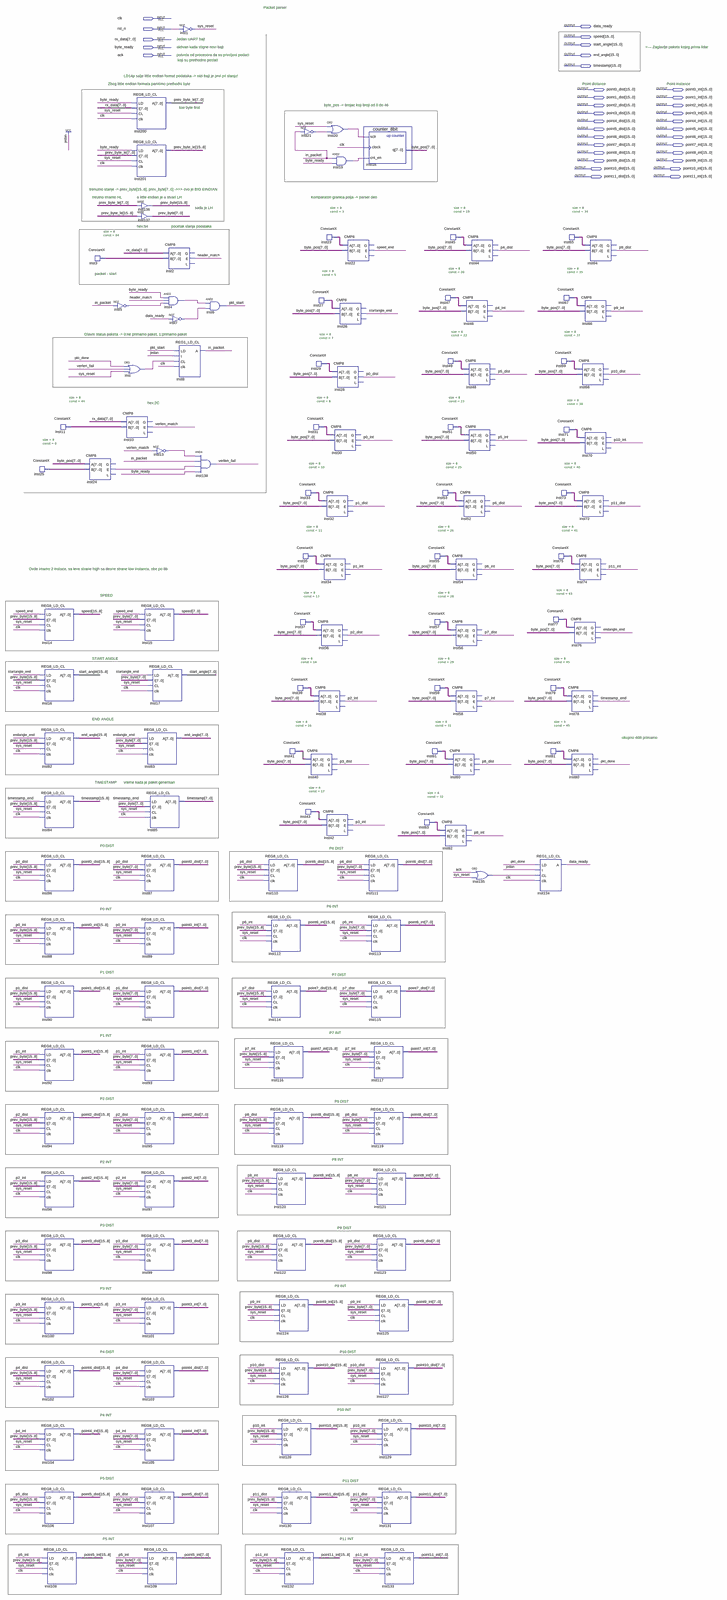
[diagram p0: schematic sheet, whole]
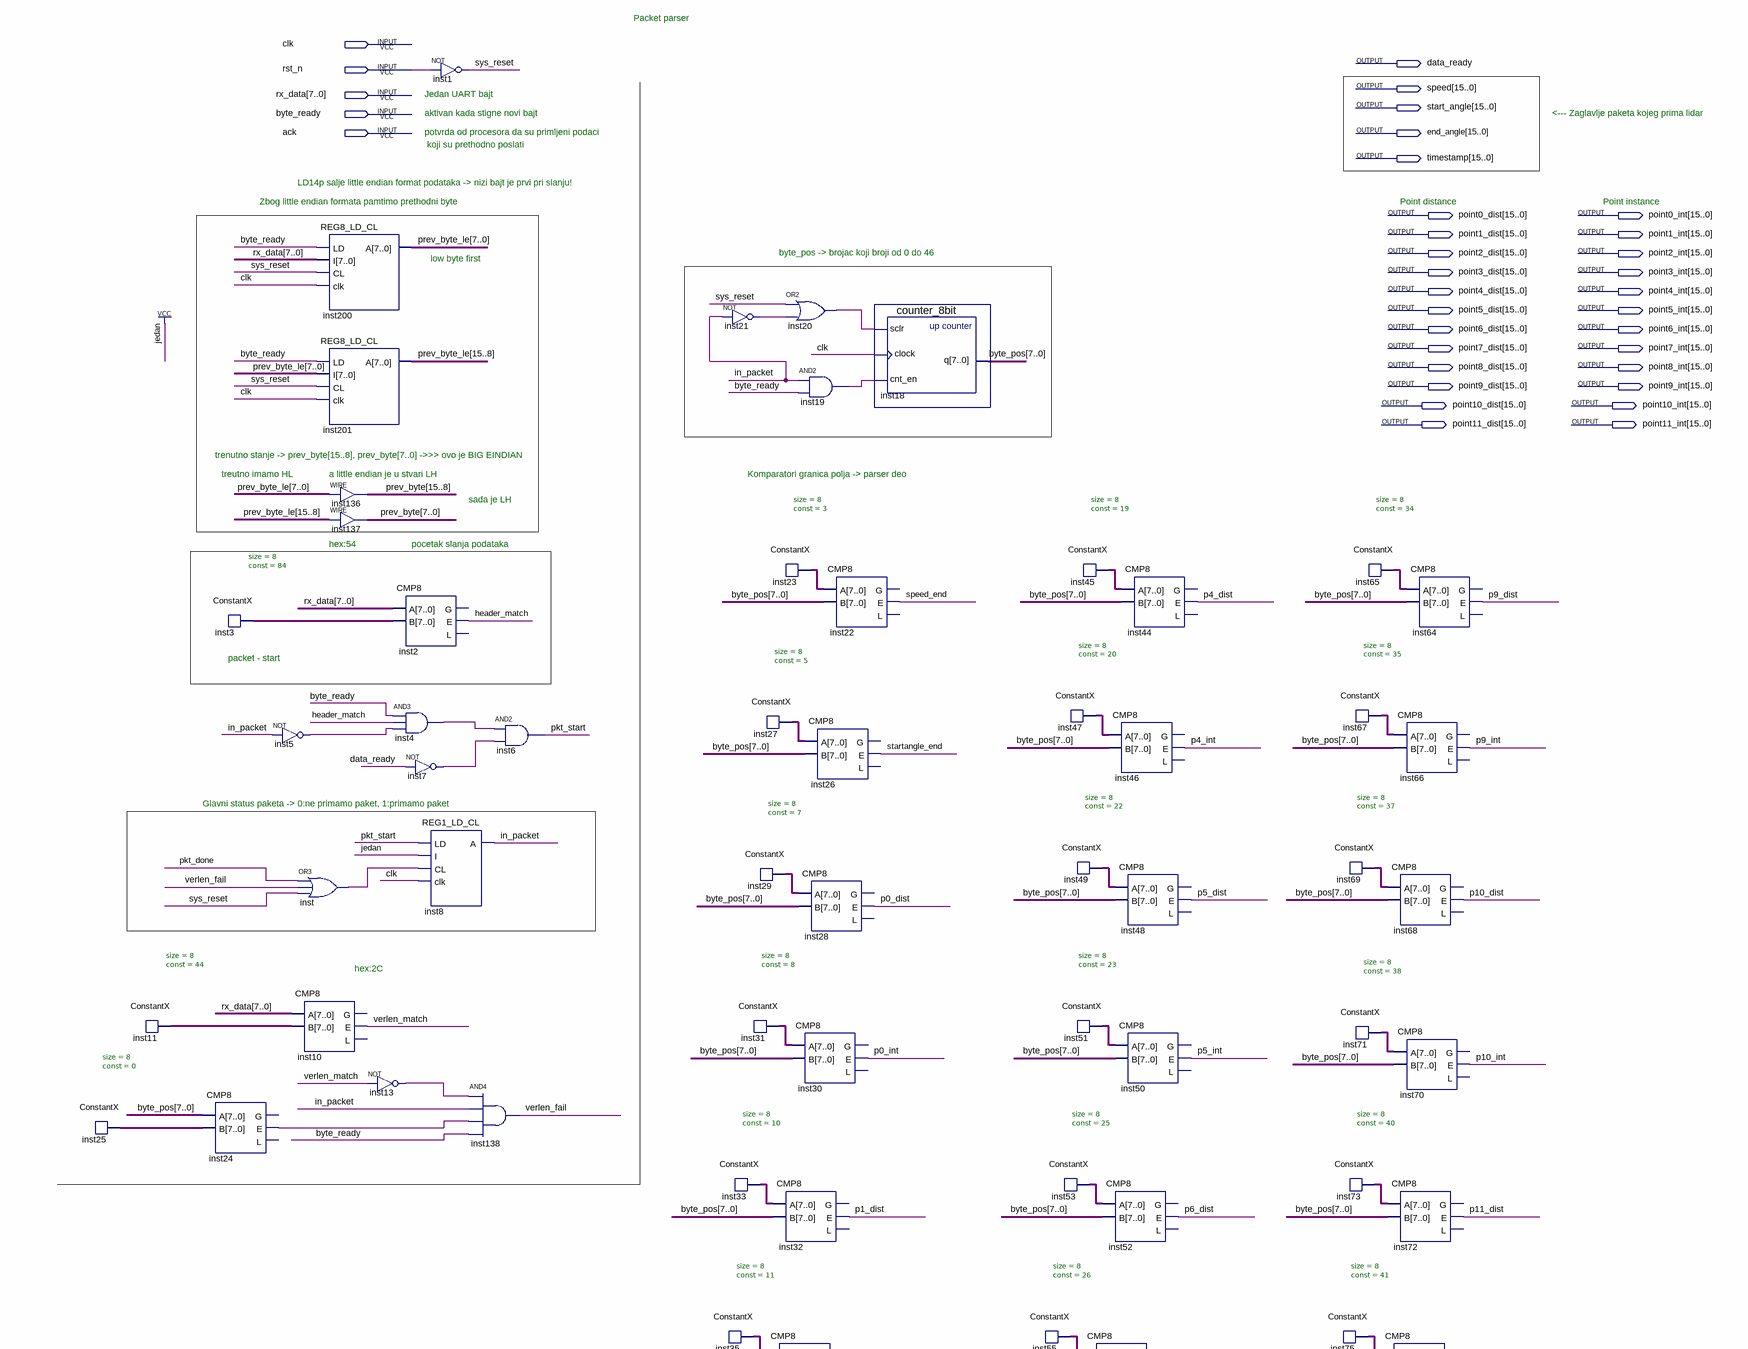
[diagram p1: schematic sheet, upper part]
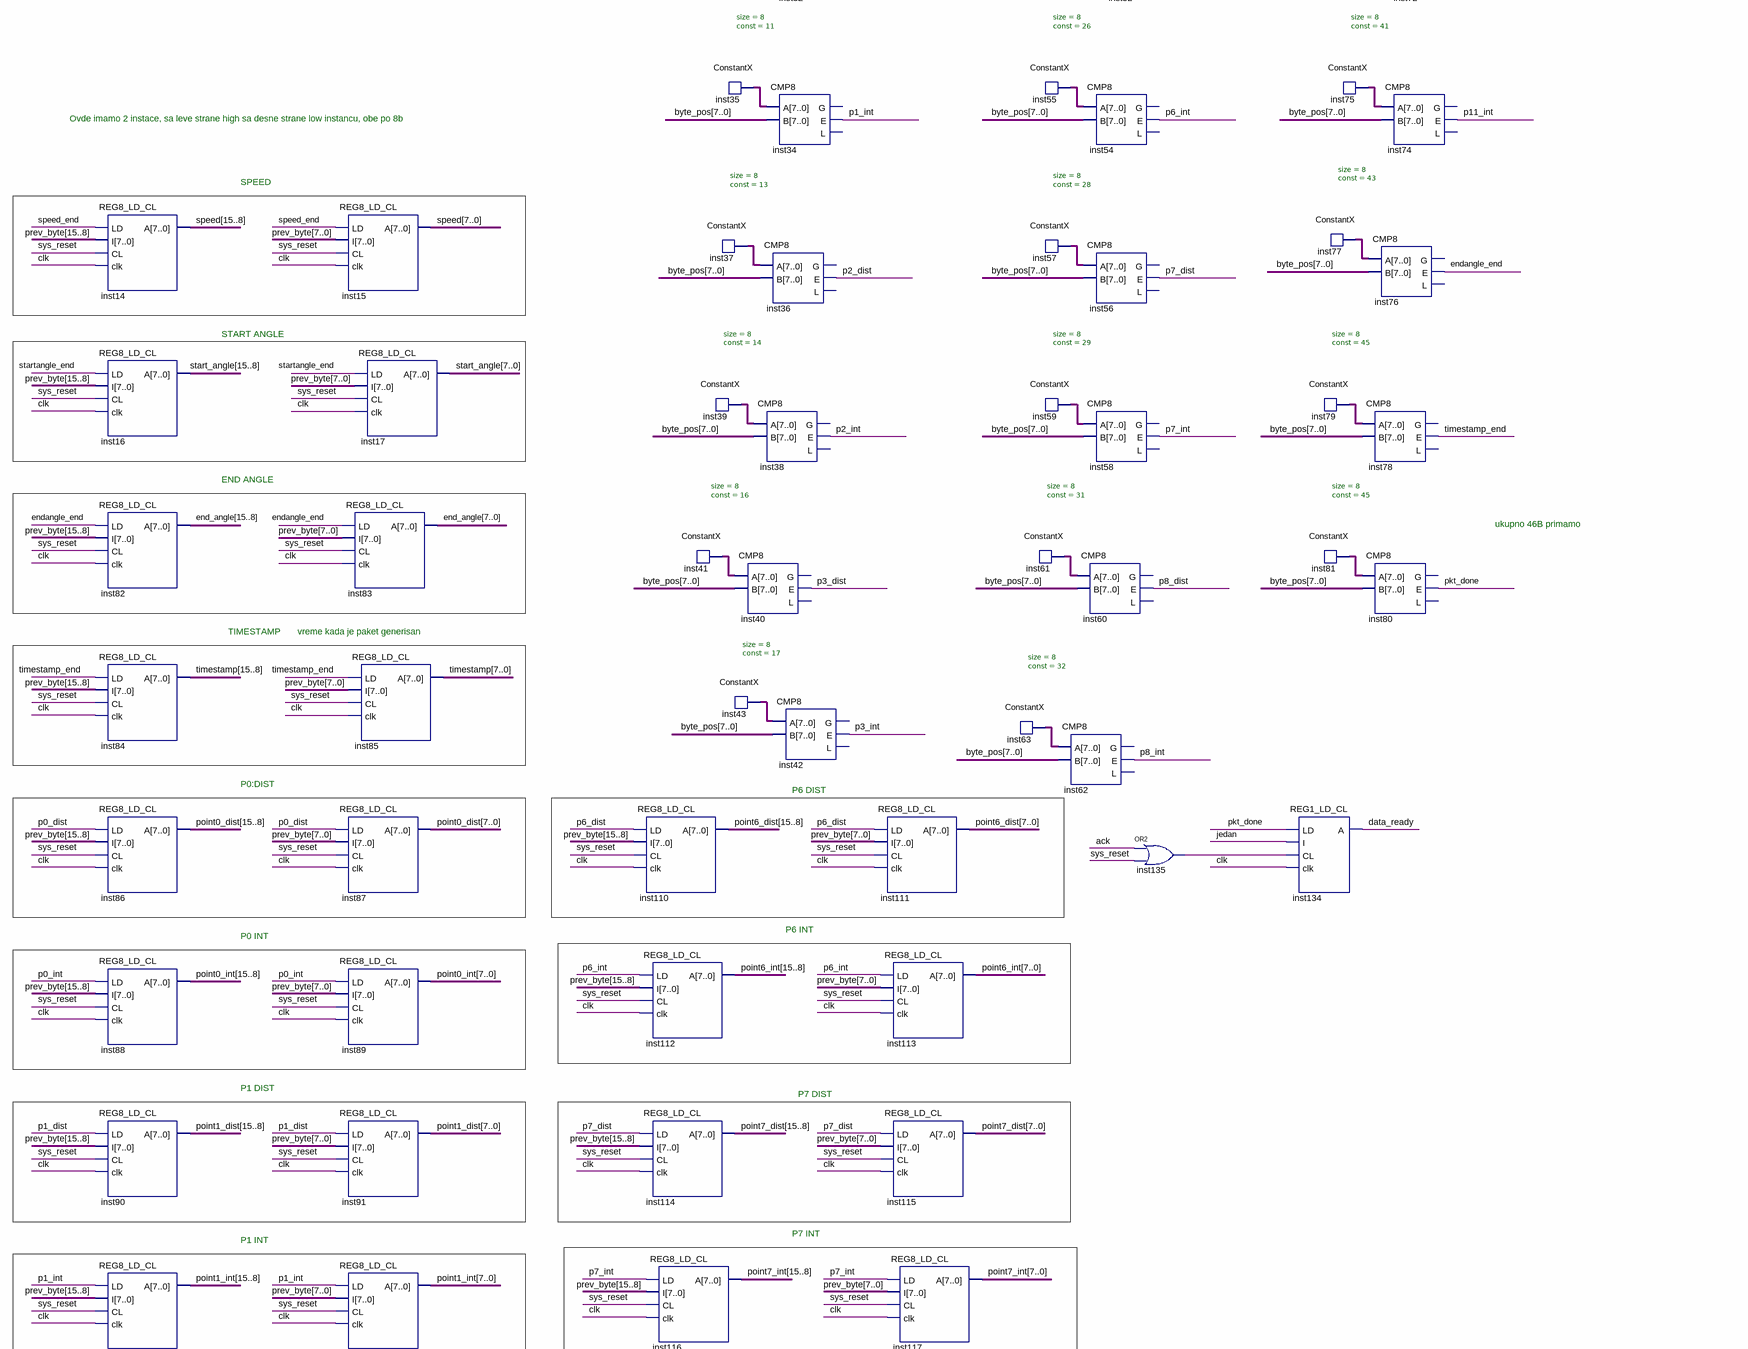
[diagram p2: schematic sheet, middle part]
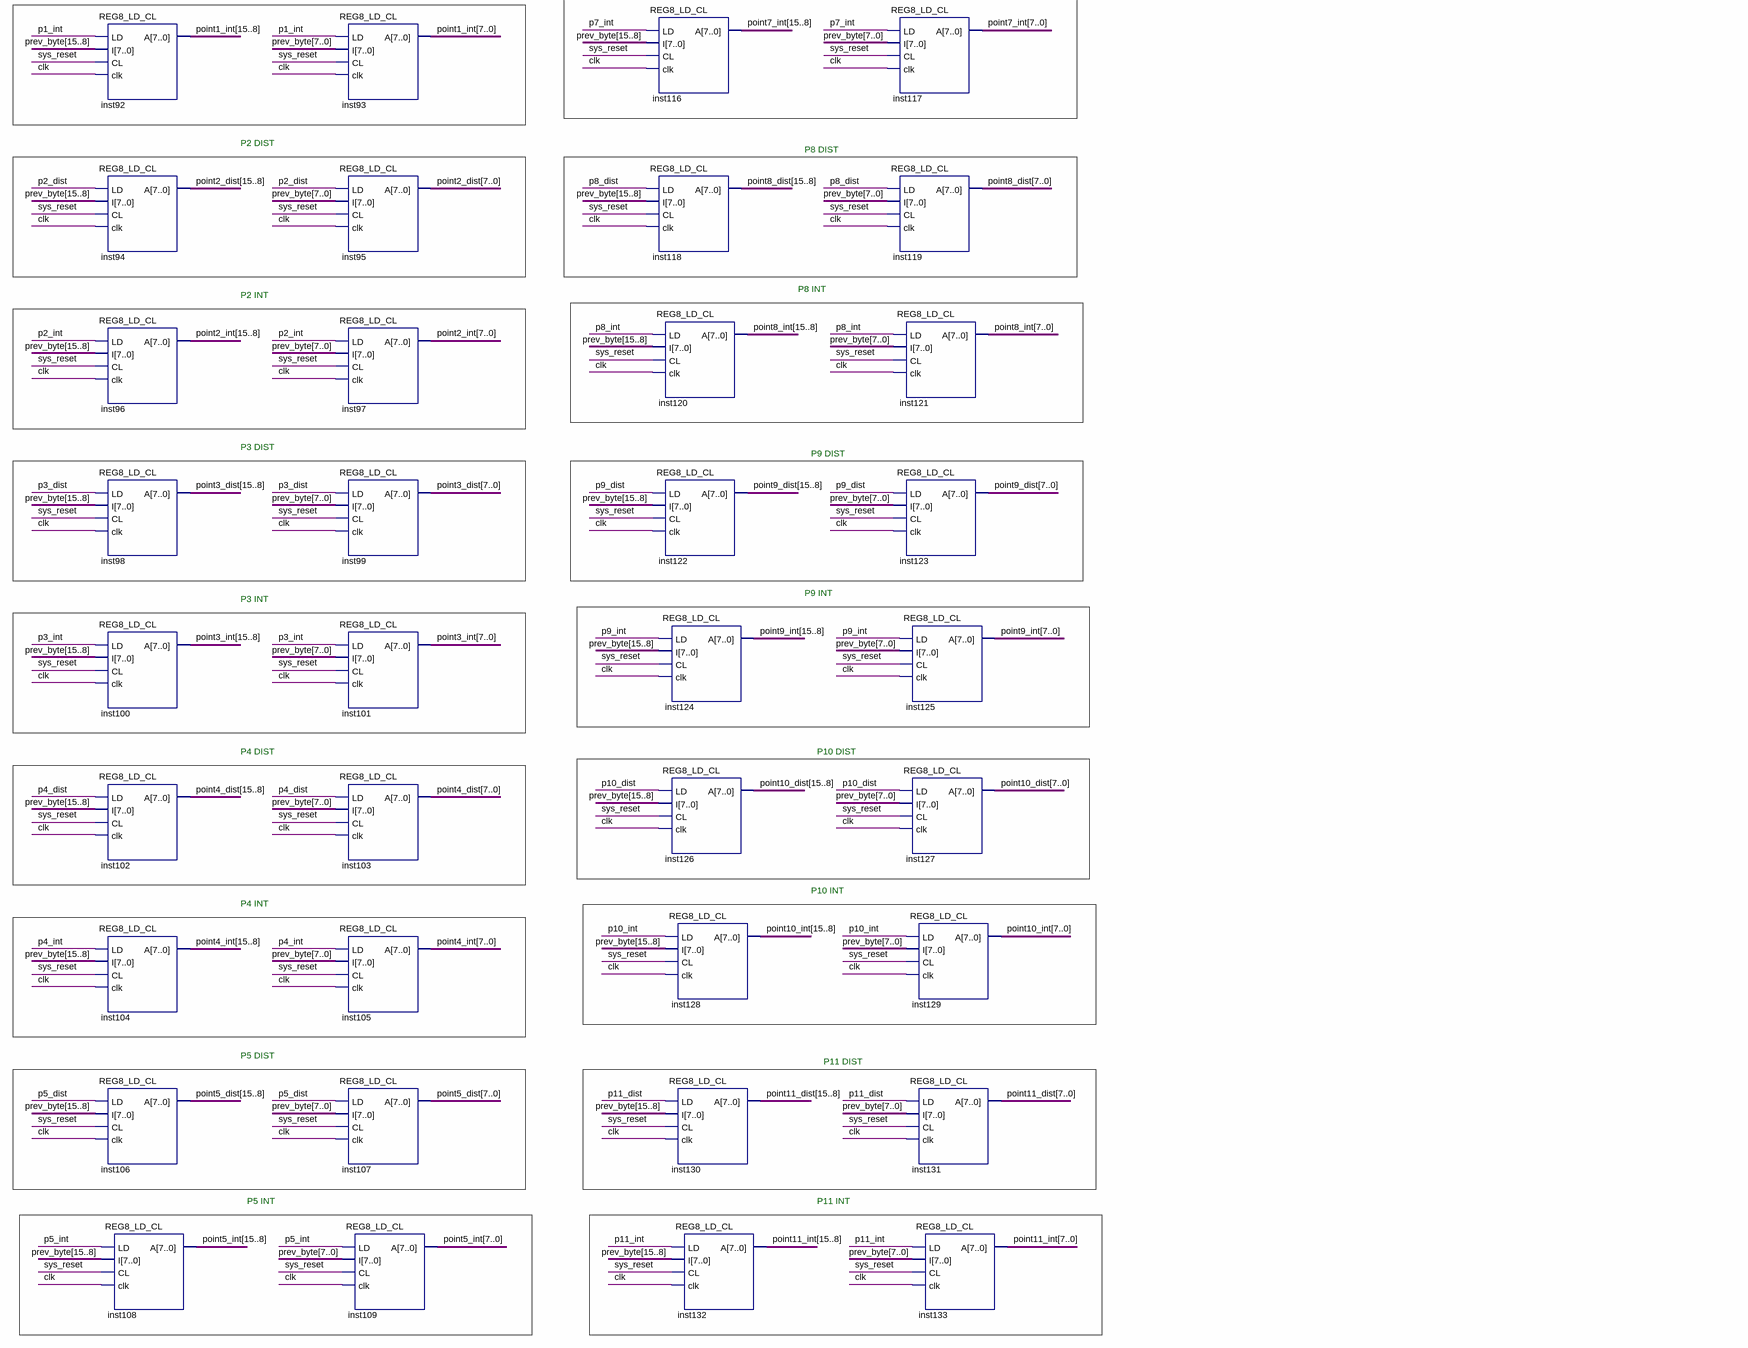
[diagram p3: schematic sheet, lower part]
// Quartus schematic PacketParser.bdf as structural Verilog: 139 symbols, 34 pins
module PacketParser (
  input  clk,
  input  rst_n,
  input  [7:0] rx_data,
  input  byte_ready,
  input  ack,
  output data_ready,
  output [15:0] speed,
  output [15:0] start_angle,
  output [15:0] end_angle,
  output [15:0] timestamp,
  output [15:0] point0_dist,
  output [15:0] point0_int,
  output [15:0] point1_dist,
  output [15:0] point1_int,
  output [15:0] point2_dist,
  output [15:0] point2_int,
  output [15:0] point3_dist,
  output [15:0] point3_int,
  output [15:0] point4_dist,
  output [15:0] point4_int,
  output [15:0] point5_dist,
  output [15:0] point5_int,
  output [15:0] point6_dist,
  output [15:0] point6_int,
  output [15:0] point7_dist,
  output [15:0] point7_int,
  output [15:0] point8_dist,
  output [15:0] point8_int,
  output [15:0] point9_dist,
  output [15:0] point9_int,
  output [15:0] point10_dist,
  output [15:0] point10_int,
  output [15:0] point11_dist,
  output [15:0] point11_int
);

  wire endangle_end, header_match, in_packet, inst4_out, inst5_out, inst7_out, inst13_out, inst19_out,
       inst20_out, inst21_out, inst24_e, inst135_out, inst_out, p0_dist, p0_int, p1_dist, p1_int, p2_dist,
       p2_int, p3_dist, p3_int, p4_dist, p4_int, p5_dist, p5_int, p6_dist, p6_int, p7_dist, p7_int, p8_dist,
       p8_int, p9_dist, p9_int, p10_dist, p10_int, p11_dist, p11_int, pkt_done, pkt_start, speed_end,
       startangle_end, sys_reset, timestamp_end, verlen_fail, verlen_match;
  wire [7:0] byte_pos, inst3_data_out, inst11_data_out, inst23_data_out, inst25_data_out, inst27_data_out,
       inst29_data_out, inst31_data_out, inst33_data_out, inst35_data_out, inst37_data_out, inst39_data_out,
       inst41_data_out, inst43_data_out, inst45_data_out, inst47_data_out, inst49_data_out, inst51_data_out,
       inst53_data_out, inst55_data_out, inst57_data_out, inst59_data_out, inst61_data_out, inst63_data_out,
       inst65_data_out, inst67_data_out, inst69_data_out, inst71_data_out, inst73_data_out, inst75_data_out,
       inst77_data_out, inst79_data_out, inst81_data_out;
  wire [15:0] prev_byte, prev_byte_le;

  ConstantX #(.size(8), .\const (0)) inst25 (.DATA_OUT(inst25_data_out));
  REG8_LD_CL inst14 (.LD(speed_end), .I(prev_byte[15:8]), .CL(sys_reset), .clk(clk), .A(speed[15:8]));
  REG8_LD_CL inst16 (.LD(startangle_end), .I(prev_byte[15:8]), .CL(sys_reset), .clk(clk), .A(start_angle[15:8]));
  REG8_LD_CL inst82 (.LD(endangle_end), .I(prev_byte[15:8]), .CL(sys_reset), .clk(clk), .A(end_angle[15:8]));
  REG8_LD_CL inst84 (.LD(timestamp_end), .I(prev_byte[15:8]), .CL(sys_reset), .clk(clk), .A(timestamp[15:8]));
  REG8_LD_CL inst86 (.LD(p0_dist), .I(prev_byte[15:8]), .CL(sys_reset), .clk(clk), .A(point0_dist[15:8]));
  REG8_LD_CL inst88 (.LD(p0_int), .I(prev_byte[15:8]), .CL(sys_reset), .clk(clk), .A(point0_int[15:8]));
  REG8_LD_CL inst90 (.LD(p1_dist), .I(prev_byte[15:8]), .CL(sys_reset), .clk(clk), .A(point1_dist[15:8]));
  REG8_LD_CL inst92 (.LD(p1_int), .I(prev_byte[15:8]), .CL(sys_reset), .clk(clk), .A(point1_int[15:8]));
  REG8_LD_CL inst94 (.LD(p2_dist), .I(prev_byte[15:8]), .CL(sys_reset), .clk(clk), .A(point2_dist[15:8]));
  REG8_LD_CL inst96 (.LD(p2_int), .I(prev_byte[15:8]), .CL(sys_reset), .clk(clk), .A(point2_int[15:8]));
  REG8_LD_CL inst98 (.LD(p3_dist), .I(prev_byte[15:8]), .CL(sys_reset), .clk(clk), .A(point3_dist[15:8]));
  REG8_LD_CL inst100 (.LD(p3_int), .I(prev_byte[15:8]), .CL(sys_reset), .clk(clk), .A(point3_int[15:8]));
  REG8_LD_CL inst102 (.LD(p4_dist), .I(prev_byte[15:8]), .CL(sys_reset), .clk(clk), .A(point4_dist[15:8]));
  REG8_LD_CL inst104 (.LD(p4_int), .I(prev_byte[15:8]), .CL(sys_reset), .clk(clk), .A(point4_int[15:8]));
  REG8_LD_CL inst106 (.LD(p5_dist), .I(prev_byte[15:8]), .CL(sys_reset), .clk(clk), .A(point5_dist[15:8]));
  REG8_LD_CL inst108 (.LD(p5_int), .I(prev_byte[15:8]), .CL(sys_reset), .clk(clk), .A(point5_int[15:8]));
  ConstantX #(.size(8), .\const (44)) inst11 (.DATA_OUT(inst11_data_out));
  ConstantX #(.size(8), .\const (84)) inst3 (.DATA_OUT(inst3_data_out));
  CMP8 inst24 (.A(byte_pos), .B(inst25_data_out), .E(inst24_e));  // open: G, L
  not inst5 (inst5_out, in_packet);
  REG8_LD_CL inst200 (.LD(byte_ready), .I(rx_data), .CL(sys_reset), .clk(clk), .A(prev_byte_le[7:0]));
  REG8_LD_CL inst201 (.LD(byte_ready), .I(prev_byte_le[7:0]), .CL(sys_reset), .clk(clk), .A(prev_byte_le[15:8]));
  or inst (inst_out, pkt_done, verlen_fail, sys_reset);
  CMP8 inst10 (.A(rx_data), .B(inst11_data_out), .E(verlen_match));  // open: G, L
  assign prev_byte[15:8] = prev_byte_le[7:0];  // WIRE inst136
  assign prev_byte[7:0] = prev_byte_le[15:8];  // WIRE inst137
  not inst13 (inst13_out, verlen_match);
  REG8_LD_CL inst15 (.LD(speed_end), .I(prev_byte[7:0]), .CL(sys_reset), .clk(clk), .A(speed[7:0]));
  REG8_LD_CL inst17 (.LD(startangle_end), .I(prev_byte[7:0]), .CL(sys_reset), .clk(clk), .A(start_angle[7:0]));
  REG8_LD_CL inst83 (.LD(endangle_end), .I(prev_byte[7:0]), .CL(sys_reset), .clk(clk), .A(end_angle[7:0]));
  REG8_LD_CL inst85 (.LD(timestamp_end), .I(prev_byte[7:0]), .CL(sys_reset), .clk(clk), .A(timestamp[7:0]));
  REG8_LD_CL inst87 (.LD(p0_dist), .I(prev_byte[7:0]), .CL(sys_reset), .clk(clk), .A(point0_dist[7:0]));
  REG8_LD_CL inst89 (.LD(p0_int), .I(prev_byte[7:0]), .CL(sys_reset), .clk(clk), .A(point0_int[7:0]));
  REG8_LD_CL inst91 (.LD(p1_dist), .I(prev_byte[7:0]), .CL(sys_reset), .clk(clk), .A(point1_dist[7:0]));
  REG8_LD_CL inst93 (.LD(p1_int), .I(prev_byte[7:0]), .CL(sys_reset), .clk(clk), .A(point1_int[7:0]));
  REG8_LD_CL inst95 (.LD(p2_dist), .I(prev_byte[7:0]), .CL(sys_reset), .clk(clk), .A(point2_dist[7:0]));
  REG8_LD_CL inst97 (.LD(p2_int), .I(prev_byte[7:0]), .CL(sys_reset), .clk(clk), .A(point2_int[7:0]));
  REG8_LD_CL inst99 (.LD(p3_dist), .I(prev_byte[7:0]), .CL(sys_reset), .clk(clk), .A(point3_dist[7:0]));
  REG8_LD_CL inst101 (.LD(p3_int), .I(prev_byte[7:0]), .CL(sys_reset), .clk(clk), .A(point3_int[7:0]));
  REG8_LD_CL inst103 (.LD(p4_dist), .I(prev_byte[7:0]), .CL(sys_reset), .clk(clk), .A(point4_dist[7:0]));
  REG8_LD_CL inst105 (.LD(p4_int), .I(prev_byte[7:0]), .CL(sys_reset), .clk(clk), .A(point4_int[7:0]));
  REG8_LD_CL inst107 (.LD(p5_dist), .I(prev_byte[7:0]), .CL(sys_reset), .clk(clk), .A(point5_dist[7:0]));
  REG8_LD_CL inst109 (.LD(p5_int), .I(prev_byte[7:0]), .CL(sys_reset), .clk(clk), .A(point5_int[7:0]));
  CMP8 inst2 (.A(rx_data), .B(inst3_data_out), .E(header_match));  // open: G, L
  and inst4 (inst4_out, byte_ready, header_match, inst5_out);
  not inst7 (inst7_out, data_ready);
  REG1_LD_CL inst8 (.LD(pkt_start), .I(1'b1), .CL(inst_out), .clk(clk), .A(in_packet));
  not inst1 (sys_reset, rst_n);
  and inst138 (verlen_fail, inst13_out, in_packet, inst24_e, byte_ready);
  and inst6 (pkt_start, inst4_out, inst7_out);
  ConstantX #(.size(8), .\const (16)) inst41 (.DATA_OUT(inst41_data_out));
  REG8_LD_CL inst110 (.LD(p6_dist), .I(prev_byte[15:8]), .CL(sys_reset), .clk(clk), .A(point6_dist[15:8]));
  REG8_LD_CL inst112 (.LD(p6_int), .I(prev_byte[15:8]), .CL(sys_reset), .clk(clk), .A(point6_int[15:8]));
  REG8_LD_CL inst114 (.LD(p7_dist), .I(prev_byte[15:8]), .CL(sys_reset), .clk(clk), .A(point7_dist[15:8]));
  REG8_LD_CL inst116 (.LD(p7_int), .I(prev_byte[15:8]), .CL(sys_reset), .clk(clk), .A(point7_int[15:8]));
  REG8_LD_CL inst118 (.LD(p8_dist), .I(prev_byte[15:8]), .CL(sys_reset), .clk(clk), .A(point8_dist[15:8]));
  REG8_LD_CL inst120 (.LD(p8_int), .I(prev_byte[15:8]), .CL(sys_reset), .clk(clk), .A(point8_int[15:8]));
  REG8_LD_CL inst122 (.LD(p9_dist), .I(prev_byte[15:8]), .CL(sys_reset), .clk(clk), .A(point9_dist[15:8]));
  REG8_LD_CL inst124 (.LD(p9_int), .I(prev_byte[15:8]), .CL(sys_reset), .clk(clk), .A(point9_int[15:8]));
  REG8_LD_CL inst126 (.LD(p10_dist), .I(prev_byte[15:8]), .CL(sys_reset), .clk(clk), .A(point10_dist[15:8]));
  REG8_LD_CL inst128 (.LD(p10_int), .I(prev_byte[15:8]), .CL(sys_reset), .clk(clk), .A(point10_int[15:8]));
  REG8_LD_CL inst130 (.LD(p11_dist), .I(prev_byte[15:8]), .CL(sys_reset), .clk(clk), .A(point11_dist[15:8]));
  REG8_LD_CL inst132 (.LD(p11_int), .I(prev_byte[15:8]), .CL(sys_reset), .clk(clk), .A(point11_int[15:8]));
  not inst21 (inst21_out, in_packet);
  ConstantX #(.size(8), .\const (10)) inst33 (.DATA_OUT(inst33_data_out));
  ConstantX #(.size(8), .\const (11)) inst35 (.DATA_OUT(inst35_data_out));
  ConstantX #(.size(8), .\const (13)) inst37 (.DATA_OUT(inst37_data_out));
  ConstantX #(.size(8), .\const (14)) inst39 (.DATA_OUT(inst39_data_out));
  ConstantX #(.size(8), .\const (17)) inst43 (.DATA_OUT(inst43_data_out));
  ConstantX #(.size(8), .\const (3)) inst23 (.DATA_OUT(inst23_data_out));
  ConstantX #(.size(8), .\const (5)) inst27 (.DATA_OUT(inst27_data_out));
  ConstantX #(.size(8), .\const (7)) inst29 (.DATA_OUT(inst29_data_out));
  ConstantX #(.size(8), .\const (8)) inst31 (.DATA_OUT(inst31_data_out));
  CMP8 inst32 (.A(inst33_data_out), .B(byte_pos), .E(p1_dist));  // open: G, L
  CMP8 inst34 (.A(inst35_data_out), .B(byte_pos), .E(p1_int));  // open: G, L
  CMP8 inst36 (.A(inst37_data_out), .B(byte_pos), .E(p2_dist));  // open: G, L
  CMP8 inst38 (.A(inst39_data_out), .B(byte_pos), .E(p2_int));  // open: G, L
  CMP8 inst40 (.A(inst41_data_out), .B(byte_pos), .E(p3_dist));  // open: G, L
  CMP8 inst42 (.A(inst43_data_out), .B(byte_pos), .E(p3_int));  // open: G, L
  or inst20 (inst20_out, sys_reset, inst21_out);
  and inst19 (inst19_out, in_packet, byte_ready);
  CMP8 inst22 (.A(inst23_data_out), .B(byte_pos), .E(speed_end));  // open: G, L
  CMP8 inst26 (.A(inst27_data_out), .B(byte_pos), .E(startangle_end));  // open: G, L
  CMP8 inst28 (.A(inst29_data_out), .B(byte_pos), .E(p0_dist));  // open: G, L
  CMP8 inst30 (.A(inst31_data_out), .B(byte_pos), .E(p0_int));  // open: G, L
  counter_8bit inst18 (.sclr(inst20_out), .clock(clk), .cnt_en(inst19_out), .q(byte_pos));
  REG8_LD_CL inst111 (.LD(p6_dist), .I(prev_byte[7:0]), .CL(sys_reset), .clk(clk), .A(point6_dist[7:0]));
  REG8_LD_CL inst113 (.LD(p6_int), .I(prev_byte[7:0]), .CL(sys_reset), .clk(clk), .A(point6_int[7:0]));
  REG8_LD_CL inst115 (.LD(p7_dist), .I(prev_byte[7:0]), .CL(sys_reset), .clk(clk), .A(point7_dist[7:0]));
  REG8_LD_CL inst117 (.LD(p7_int), .I(prev_byte[7:0]), .CL(sys_reset), .clk(clk), .A(point7_int[7:0]));
  REG8_LD_CL inst119 (.LD(p8_dist), .I(prev_byte[7:0]), .CL(sys_reset), .clk(clk), .A(point8_dist[7:0]));
  REG8_LD_CL inst121 (.LD(p8_int), .I(prev_byte[7:0]), .CL(sys_reset), .clk(clk), .A(point8_int[7:0]));
  REG8_LD_CL inst123 (.LD(p9_dist), .I(prev_byte[7:0]), .CL(sys_reset), .clk(clk), .A(point9_dist[7:0]));
  REG8_LD_CL inst125 (.LD(p9_int), .I(prev_byte[7:0]), .CL(sys_reset), .clk(clk), .A(point9_int[7:0]));
  REG8_LD_CL inst127 (.LD(p10_dist), .I(prev_byte[7:0]), .CL(sys_reset), .clk(clk), .A(point10_dist[7:0]));
  REG8_LD_CL inst129 (.LD(p10_int), .I(prev_byte[7:0]), .CL(sys_reset), .clk(clk), .A(point10_int[7:0]));
  REG8_LD_CL inst131 (.LD(p11_dist), .I(prev_byte[7:0]), .CL(sys_reset), .clk(clk), .A(point11_dist[7:0]));
  REG8_LD_CL inst133 (.LD(p11_int), .I(prev_byte[7:0]), .CL(sys_reset), .clk(clk), .A(point11_int[7:0]));
  ConstantX #(.size(8), .\const (26)) inst55 (.DATA_OUT(inst55_data_out));
  ConstantX #(.size(8), .\const (28)) inst57 (.DATA_OUT(inst57_data_out));
  ConstantX #(.size(8), .\const (29)) inst59 (.DATA_OUT(inst59_data_out));
  ConstantX #(.size(8), .\const (31)) inst61 (.DATA_OUT(inst61_data_out));
  ConstantX #(.size(8), .\const (32)) inst63 (.DATA_OUT(inst63_data_out));
  ConstantX #(.size(8), .\const (19)) inst45 (.DATA_OUT(inst45_data_out));
  ConstantX #(.size(8), .\const (20)) inst47 (.DATA_OUT(inst47_data_out));
  ConstantX #(.size(8), .\const (22)) inst49 (.DATA_OUT(inst49_data_out));
  ConstantX #(.size(8), .\const (23)) inst51 (.DATA_OUT(inst51_data_out));
  ConstantX #(.size(8), .\const (25)) inst53 (.DATA_OUT(inst53_data_out));
  CMP8 inst54 (.A(inst55_data_out), .B(byte_pos), .E(p6_int));  // open: G, L
  CMP8 inst56 (.A(inst57_data_out), .B(byte_pos), .E(p7_dist));  // open: G, L
  CMP8 inst58 (.A(inst59_data_out), .B(byte_pos), .E(p7_int));  // open: G, L
  CMP8 inst60 (.A(inst61_data_out), .B(byte_pos), .E(p8_dist));  // open: G, L
  CMP8 inst62 (.A(inst63_data_out), .B(byte_pos), .E(p8_int));  // open: G, L
  CMP8 inst44 (.A(inst45_data_out), .B(byte_pos), .E(p4_dist));  // open: G, L
  CMP8 inst46 (.A(inst47_data_out), .B(byte_pos), .E(p4_int));  // open: G, L
  CMP8 inst48 (.A(inst49_data_out), .B(byte_pos), .E(p5_dist));  // open: G, L
  CMP8 inst50 (.A(inst51_data_out), .B(byte_pos), .E(p5_int));  // open: G, L
  CMP8 inst52 (.A(inst53_data_out), .B(byte_pos), .E(p6_dist));  // open: G, L
  or inst135 (inst135_out, ack, sys_reset);
  REG1_LD_CL inst134 (.LD(pkt_done), .I(1'b1), .CL(inst135_out), .clk(clk), .A(data_ready));
  ConstantX #(.size(8), .\const (35)) inst67 (.DATA_OUT(inst67_data_out));
  ConstantX #(.size(8), .\const (37)) inst69 (.DATA_OUT(inst69_data_out));
  ConstantX #(.size(8), .\const (38)) inst71 (.DATA_OUT(inst71_data_out));
  ConstantX #(.size(8), .\const (40)) inst73 (.DATA_OUT(inst73_data_out));
  ConstantX #(.size(8), .\const (41)) inst75 (.DATA_OUT(inst75_data_out));
  ConstantX #(.size(8), .\const (43)) inst77 (.DATA_OUT(inst77_data_out));
  ConstantX #(.size(8), .\const (45)) inst79 (.DATA_OUT(inst79_data_out));
  ConstantX #(.size(8), .\const (45)) inst81 (.DATA_OUT(inst81_data_out));
  ConstantX #(.size(8), .\const (34)) inst65 (.DATA_OUT(inst65_data_out));
  CMP8 inst68 (.A(inst69_data_out), .B(byte_pos), .E(p10_dist));  // open: G, L
  CMP8 inst72 (.A(inst73_data_out), .B(byte_pos), .E(p11_dist));  // open: G, L
  CMP8 inst74 (.A(inst75_data_out), .B(byte_pos), .E(p11_int));  // open: G, L
  CMP8 inst76 (.A(inst77_data_out), .B(byte_pos), .E(endangle_end));  // open: G, L
  CMP8 inst78 (.A(inst79_data_out), .B(byte_pos), .E(timestamp_end));  // open: G, L
  CMP8 inst80 (.A(inst81_data_out), .B(byte_pos), .E(pkt_done));  // open: G, L
  CMP8 inst64 (.A(inst65_data_out), .B(byte_pos), .E(p9_dist));  // open: G, L
  CMP8 inst66 (.A(inst67_data_out), .B(byte_pos), .E(p9_int));  // open: G, L
  CMP8 inst70 (.A(inst71_data_out), .B(byte_pos), .E(p10_int));  // open: G, L

  // Notes on the sheet:
  //   Packet parser
  //   Jedan UART bajt
  //   aktivan kada stigne novi bajt
  //   <--- Zaglavlje paketa kojeg prima lidar
  //   potvrda od procesora da su primljeni podaci
  //    koji su prethodno poslati
  //   LD14p salje little endian format podataka -> nizi bajt je prvi pri slanju!
  //   Zbog little endian formata pamtimo prethodni byte
  //   Point distance
  //   Point instance
  //   byte_pos -> brojac koji broji od 0 do 46
  //   low byte first
  //   trenutno stanje -> prev_byte[15..8], prev_byte[7..0] ->>> ovo je BIG EINDIAN
  //   treutno imamo HL
  //   a little endian je u stvari LH
  //   Komparatori granica polja -> parser deo
  //   sada je LH
  //   hex:54
  //   pocetak slanja podataka
  //   packet - start
  //   Glavni status paketa -> 0:ne primamo paket, 1:primamo paket
  //   hex:2C
  //   Ovde imamo 2 instace, sa leve strane high sa desne strane low instancu, obe po 8b
  //   SPEED
  //   START ANGLE
  //   END ANGLE
  //   ukupno 46B primamo
  //   TIMESTAMP
  //   vreme kada je paket generisan
  //   P0:DIST
  //   P6 DIST
  //   P6 INT
  //   P0 INT
  //   P1 DIST
  //   P7 DIST
  //   P7 INT
  //   P1 INT
  //   P2 DIST
  //   P8 DIST
  //   P8 INT
  //   P2 INT
  //   P3 DIST
  //   P9 DIST
  //   P9 INT
  //   P3 INT
  //   P4 DIST
  //   P10 DIST
  //   P10 INT
  //   P4 INT
  //   P5 DIST
  //   P11 DIST
  //   P5 INT
  //   P11 INT
endmodule
